# EAGLE schematic stages_v70 (EAGLE 5.09)

## Sheet 1 of 6
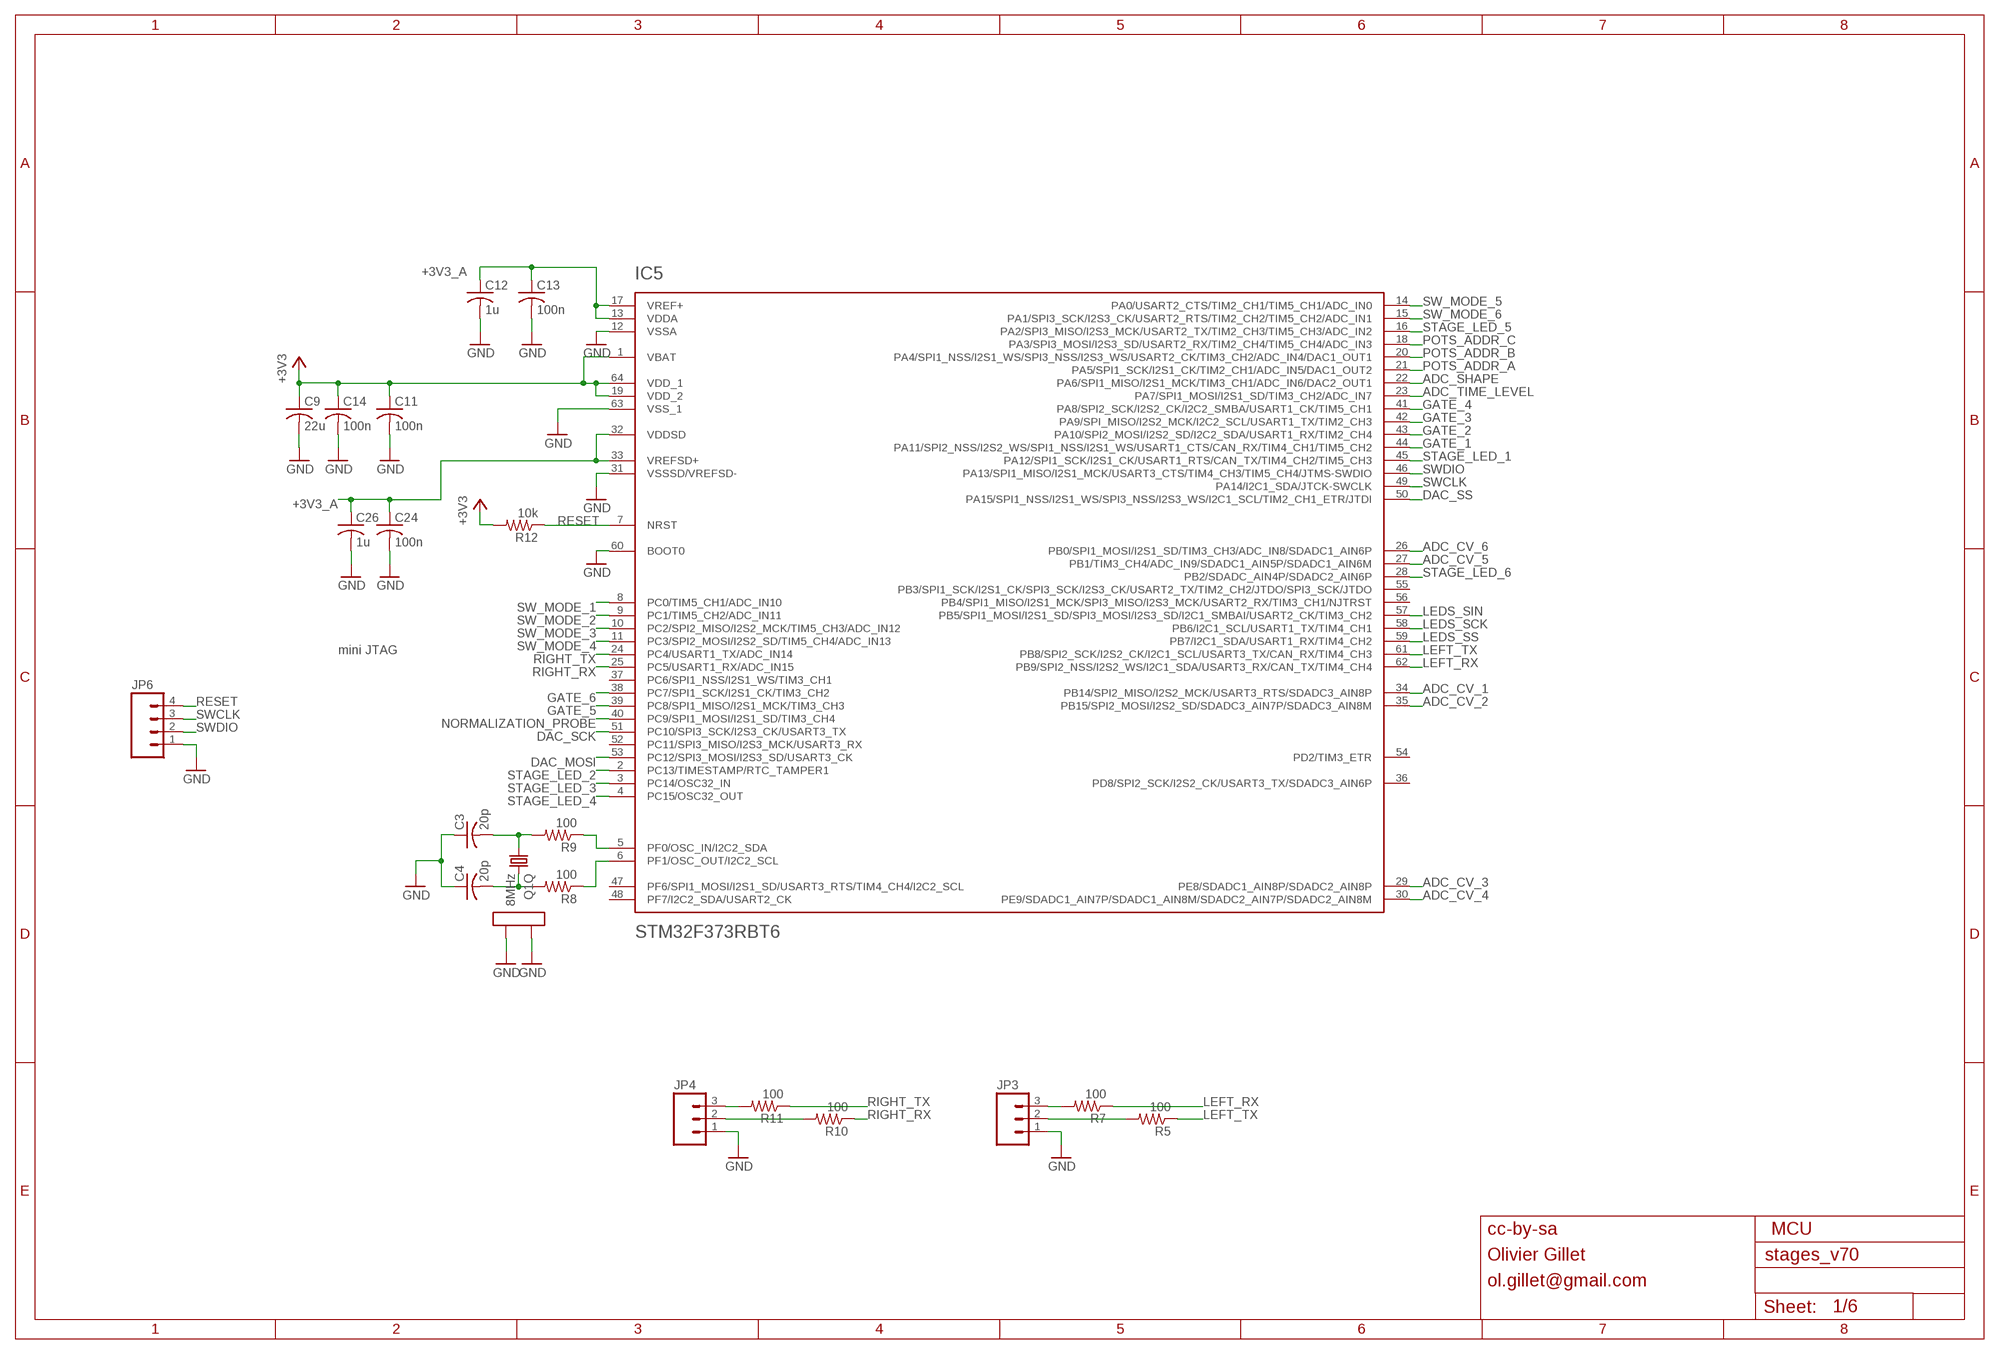
[diagram p0: schematic, sheet 1]

### Parts
C3  20p  C-USC0402  [C0402]
C4  20p  C-USC0402  [C0402]
C9  22u  C-USC1206  [C1206]
C11  100n  C-USC0402  [C0402]
C12  1u  C-USC0402  [C0402]
C13  100n  C-USC0402  [C0402]
C14  100n  C-USC0402  [C0402]
C24  100n  C-USC0402  [C0402]
C26  1u  C-USC0402  [C0402]
IC5  STM32F373RBT6  STM32F373R  [TQFP-10X10-64]
JP3  M03PTH  [1X03]
JP4  M03PTH  [1X03]
JP6  M04PTH  [1X04]
Q1  8MHz  CRYSTAL  [CTS406]
R5  100  R-US_R0402  [R0402]
R7  100  R-US_R0402  [R0402]
R8  100  R-US_R0402  [R0402]
R9  100  R-US_R0402  [R0402]
R10  100  R-US_R0402  [R0402]
R11  100  R-US_R0402  [R0402]
R12  10k  R-US_R0402  [R0402]

### Nets
+3V3: C9.1 C11.1 C14.1 IC5.1(VBAT) IC5.19(VDD_2) IC5.64(VDD_1) R12.2 ; also sheet 2,4,6
+3V3_A: C12.1 C13.1 C24.1 C26.1 IC5.13(VDDA) IC5.17(VREF+) IC5.32(VDDSD) IC5.33(VREFSD+) ; also sheet 2,3,5,6
ADC_CV_1: IC5.34(PB14/SPI2_MISO/I2S2_MCK/USART3_RTS/SDADC3_AIN8P) ; also sheet 3
ADC_CV_2: IC5.35(PB15/SPI2_MOSI/I2S2_SD/SDADC3_AIN7P/SDADC3_AIN8M) ; also sheet 3
ADC_CV_3: IC5.29(PE8/SDADC1_AIN8P/SDADC2_AIN8P) ; also sheet 3
ADC_CV_4: IC5.30(PE9/SDADC1_AIN7P/SDADC1_AIN8M/SDADC2_AIN7P/SDADC2_AIN8M) ; also sheet 3
ADC_CV_5: IC5.27(PB1/TIM3_CH4/ADC_IN9/SDADC1_AIN5P/SDADC1_AIN6M) ; also sheet 3
ADC_CV_6: IC5.26(PB0/SPI1_MOSI/I2S1_SD/TIM3_CH3/ADC_IN8/SDADC1_AIN6P) ; also sheet 3
ADC_SHAPE: IC5.22(PA6/SPI1_MISO/I2S1_MCK/TIM3_CH1/ADC_IN6/DAC2_OUT1) ; also sheet 2
ADC_TIME_LEVEL: IC5.23(PA7/SPI1_MOSI/I2S1_SD/TIM3_CH2/ADC_IN7) ; also sheet 2
DAC_MOSI: IC5.53(PC12/SPI3_MOSI/I2S3_SD/USART3_CK) ; also sheet 5
DAC_SCK: IC5.51(PC10/SPI3_SCK/I2S3_CK/USART3_TX) ; also sheet 5
DAC_SS: IC5.50(PA15/SPI1_NSS/I2S1_WS/SPI3_NSS/I2S3_WS/I2C1_SCL/TIM2_CH1_ETR/JTDI) ; also sheet 5
GATE_1: IC5.44(PA11/SPI2_NSS/I2S2_WS/SPI1_NSS/I2S1_WS/USART1_CTS/CAN_RX/TIM4_CH1/TIM5_CH2) ; also sheet 4
GATE_2: IC5.43(PA10/SPI2_MOSI/I2S2_SD/I2C2_SDA/USART1_RX/TIM2_CH4) ; also sheet 4
GATE_3: IC5.42(PA9/SPI_MISO/I2S2_MCK/I2C2_SCL/USART1_TX/TIM2_CH3) ; also sheet 4
GATE_4: IC5.41(PA8/SPI2_SCK/I2S2_CK/I2C2_SMBA/USART1_CK/TIM5_CH1) ; also sheet 4
GATE_5: IC5.39(PC8/SPI1_MISO/I2S1_MCK/TIM3_CH3) ; also sheet 4
GATE_6: IC5.38(PC7/SPI1_SCK/I2S1_CK/TIM3_CH2) ; also sheet 4
GND: C3.1 C4.1 C9.2 C11.2 C12.2 C13.2 C14.2 C24.2 C26.2 IC5.12(VSSA) IC5.31(VSSSD/VREFSD-) IC5.60(BOOT0) IC5.63(VSS_1) JP3.1 JP4.1 JP6.1 Q1.2(LID1) Q1.4(LID2) ; also sheet 2,3,4,5,6
LEDS_SCK: IC5.58(PB6/I2C1_SCL/USART1_TX/TIM4_CH1) ; also sheet 2
LEDS_SIN: IC5.57(PB5/SPI1_MOSI/I2S1_SD/SPI3_MOSI/I2S3_SD/I2C1_SMBAI/USART2_CK/TIM3_CH2) ; also sheet 2
LEDS_SS: IC5.59(PB7/I2C1_SDA/USART1_RX/TIM4_CH2) ; also sheet 2
LEFT_RX: IC5.62(PB9/SPI2_NSS/I2S2_WS/I2C1_SDA/USART3_RX/CAN_TX/TIM4_CH4) R7.1
LEFT_RX_R: JP3.3 R7.2
LEFT_TX: IC5.61(PB8/SPI2_SCK/I2S2_CK/I2C1_SCL/USART3_TX/CAN_RX/TIM4_CH3) R5.1
LEFT_TX_R: JP3.2 R5.2
N$7: C3.2 Q1.1 R9.2
N$8: C4.2 Q1.3 R8.2
N$15: IC5.5(PF0/OSC_IN/I2C2_SDA) R9.1
N$29: IC5.6(PF1/OSC_OUT/I2C2_SCL) R8.1
NORMALIZATION_PROBE: IC5.40(PC9/SPI1_MOSI/I2S1_SD/TIM3_CH4) ; also sheet 4
POTS_ADDR_A: IC5.21(PA5/SPI1_SCK/I2S1_CK/TIM2_CH1/ADC_IN5/DAC1_OUT2) ; also sheet 2
POTS_ADDR_B: IC5.20(PA4/SPI1_NSS/I2S1_WS/SPI3_NSS/I2S3_WS/USART2_CK/TIM3_CH2/ADC_IN4/DAC1_OUT1) ; also sheet 2
POTS_ADDR_C: IC5.18(PA3/SPI3_MOSI/I2S3_SD/USART2_RX/TIM2_CH4/TIM5_CH4/ADC_IN3) ; also sheet 2
RESET: IC5.7(NRST) JP6.4 R12.1
RIGHT_RX: IC5.25(PC5/USART1_RX/ADC_IN15) R10.1
RIGHT_RX_R: JP4.2 R10.2
RIGHT_TX: IC5.24(PC4/USART1_TX/ADC_IN14) R11.1
RIGHT_TX_R: JP4.3 R11.2
STAGE_LED_1: IC5.45(PA12/SPI1_SCK/I2S1_CK/USART1_RTS/CAN_TX/TIM4_CH2/TIM5_CH3) ; also sheet 2
STAGE_LED_2: IC5.2(PC13/TIMESTAMP/RTC_TAMPER1) ; also sheet 2
STAGE_LED_3: IC5.3(PC14/OSC32_IN) ; also sheet 2
STAGE_LED_4: IC5.4(PC15/OSC32_OUT) ; also sheet 2
STAGE_LED_5: IC5.16(PA2/SPI3_MISO/I2S3_MCK/USART2_TX/TIM2_CH3/TIM5_CH3/ADC_IN2) ; also sheet 2
STAGE_LED_6: IC5.28(PB2/SDADC_AIN4P/SDADC2_AIN6P) ; also sheet 2
SW_MODE_1: IC5.8(PC0/TIM5_CH1/ADC_IN10) ; also sheet 2
SW_MODE_2: IC5.9(PC1/TIM5_CH2/ADC_IN11) ; also sheet 2
SW_MODE_3: IC5.10(PC2/SPI2_MISO/I2S2_MCK/TIM5_CH3/ADC_IN12) ; also sheet 2
SW_MODE_4: IC5.11(PC3/SPI2_MOSI/I2S2_SD/TIM5_CH4/ADC_IN13) ; also sheet 2
SW_MODE_5: IC5.14(PA0/USART2_CTS/TIM2_CH1/TIM5_CH1/ADC_IN0) ; also sheet 2
SW_MODE_6: IC5.15(PA1/SPI3_SCK/I2S3_CK/USART2_RTS/TIM2_CH2/TIM5_CH2/ADC_IN1) ; also sheet 2
SWCLK: IC5.49(PA14/I2C1_SDA/JTCK-SWCLK) JP6.3
SWDIO: IC5.46(PA13/SPI1_MISO/I2S1_MCK/USART3_CTS/TIM4_CH3/TIM5_CH4/JTMS-SWDIO) JP6.2
Unconnected: IC5.36(PD8/SPI2_SCK/I2S2_CK/USART3_TX/SDADC3_AIN6P) IC5.37(PC6/SPI1_NSS/I2S1_WS/TIM3_CH1) IC5.47(PF6/SPI1_MOSI/I2S1_SD/USART3_RTS/TIM4_CH4/I2C2_SCL) IC5.48(PF7/I2C2_SDA/USART2_CK) IC5.52(PC11/SPI3_MISO/I2S3_MCK/USART3_RX) IC5.54(PD2/TIM3_ETR) IC5.55(PB3/SPI1_SCK/I2S1_CK/SPI3_SCK/I2S3_CK/USART2_TX/TIM2_CH2/JTDO/SPI3_SCK/JTDO) IC5.56(PB4/SPI1_MISO/I2S1_MCK/SPI3_MISO/I2S3_MCK/USART2_RX/TIM3_CH1/NJTRST)

### Notes on the sheet
- mini JTAG
- cc-by-sa | MCU
- Olivier Gillet
- ol.gillet@gmail.com

## Sheet 2 of 6
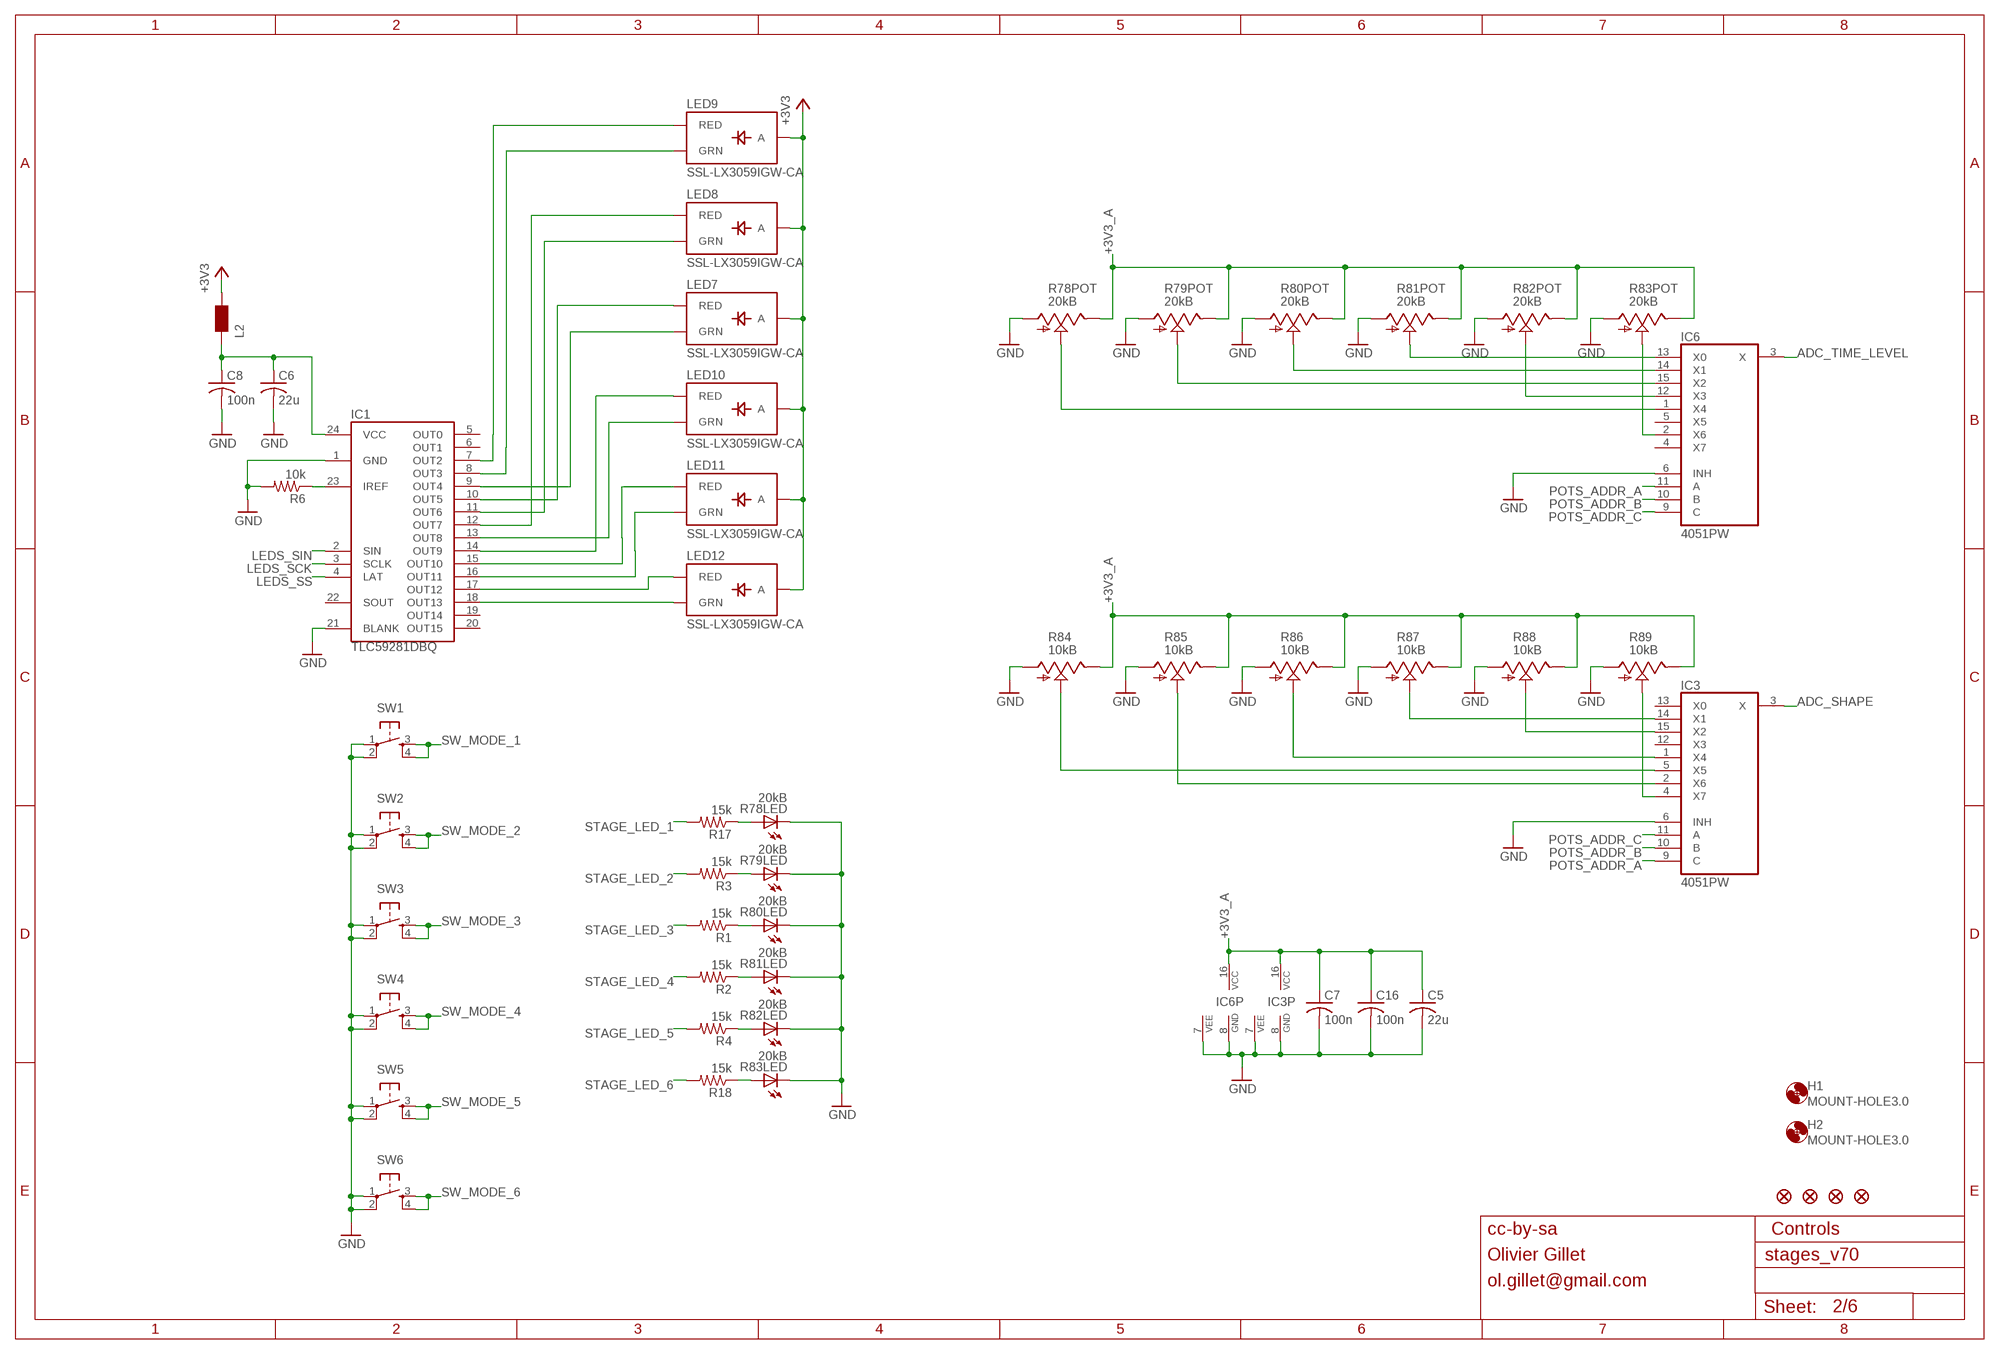
[diagram p1: schematic, sheet 2]

### Parts
C5  22u  C-USC1206  [C1206]
C6  22u  C-USC1206  [C1206]
C7  100n  C-USC0402  [C0402]
C8  100n  C-USC0402  [C0402]
C16  100n  C-USC0402  [C0402]
H1  MOUNT-HOLE3.0  [3,0]
H2  MOUNT-HOLE3.0  [3,0]
IC1  TLC59281DBQ  [TSSOP24_0635]
IC3  4051PW  [TSSOP16_065]
IC6  4051PW  [TSSOP16_065]
JP1  FIDUCIAL1X2  [FIDUCIAL-1X2]
JP2  FIDUCIAL1X2  [FIDUCIAL-1X2]
JP7  FIDUCIAL1X2  [FIDUCIAL-1X2]
JP8  FIDUCIAL1X2  [FIDUCIAL-1X2]
L2  WE-CBF_0603  [0603]
LED7  SSL-LX3059IGW-CA  LED-BICOLOR-THROUGHHOLE-CA  [LED-BICOLOR-THROUGHHOLE-LUMEX]
LED8  SSL-LX3059IGW-CA  LED-BICOLOR-THROUGHHOLE-CA  [LED-BICOLOR-THROUGHHOLE-LUMEX]
LED9  SSL-LX3059IGW-CA  LED-BICOLOR-THROUGHHOLE-CA  [LED-BICOLOR-THROUGHHOLE-LUMEX]
LED10  SSL-LX3059IGW-CA  LED-BICOLOR-THROUGHHOLE-CA  [LED-BICOLOR-THROUGHHOLE-LUMEX]
LED11  SSL-LX3059IGW-CA  LED-BICOLOR-THROUGHHOLE-CA  [LED-BICOLOR-THROUGHHOLE-LUMEX]
LED12  SSL-LX3059IGW-CA  LED-BICOLOR-THROUGHHOLE-CA  [LED-BICOLOR-THROUGHHOLE-LUMEX]
R1  15k  R-US_R0402  [R0402]
R2  15k  R-US_R0402  [R0402]
R3  15k  R-US_R0402  [R0402]
R4  15k  R-US_R0402  [R0402]
R6  10k  R-US_R0402  [R0402]
R17  15k  R-US_R0402  [R0402]
R18  15k  R-US_R0402  [R0402]
R78  20kB  BOURNS_SLIDER  [BOURNS_SLIDER]
R79  20kB  BOURNS_SLIDER  [BOURNS_SLIDER]
R80  20kB  BOURNS_SLIDER  [BOURNS_SLIDER]
R81  20kB  BOURNS_SLIDER  [BOURNS_SLIDER]
R82  20kB  BOURNS_SLIDER  [BOURNS_SLIDER]
R83  20kB  BOURNS_SLIDER  [BOURNS_SLIDER]
R84  10kB  POT_USVERTICAL_NARROW  [ALPS_POT_NARROW]
R85  10kB  POT_USVERTICAL_NARROW  [ALPS_POT_NARROW]
R86  10kB  POT_USVERTICAL_NARROW  [ALPS_POT_NARROW]
R87  10kB  POT_USVERTICAL_NARROW  [ALPS_POT_NARROW]
R88  10kB  POT_USVERTICAL_NARROW  [ALPS_POT_NARROW]
R89  10kB  POT_USVERTICAL_NARROW  [ALPS_POT_NARROW]
SW1  TAC_SWITCHPTH  [TACTILE-PTH]
SW2  TAC_SWITCHPTH  [TACTILE-PTH]
SW3  TAC_SWITCHPTH  [TACTILE-PTH]
SW4  TAC_SWITCHPTH  [TACTILE-PTH]
SW5  TAC_SWITCHPTH  [TACTILE-PTH]
SW6  TAC_SWITCHPTH  [TACTILE-PTH]

### Nets
+3V3: L2.2 LED7.A LED8.A LED9.A LED10.A LED11.A LED12.A ; also sheet 1,4,6
+3V3_A: C5.1 C7.1 C16.1 IC3.16(VCC) IC6.16(VCC) R78.3(POT:E) R79.3(POT:E) R80.3(POT:E) R81.3(POT:E) R82.3(POT:E) R83.3(POT:E) R84.P$1(E) R85.P$1(E) R86.P$1(E) R87.P$1(E) R88.P$1(E) R89.P$1(E) ; also sheet 1,3,5,6
ADC_SHAPE: IC3.3(X) ; also sheet 1
ADC_TIME_LEVEL: IC6.3(X) ; also sheet 1
GND: C5.2 C6.2 C7.2 C8.2 C16.2 IC1.1(GND) IC1.21(BLANK) IC3.6(INH) IC3.7(VEE) IC3.8(GND) IC6.6(INH) IC6.7(VEE) IC6.8(GND) R6.2 R78.1(POT:A) R78.E(LED:C) R79.1(POT:A) R79.E(LED:C) R80.1(POT:A) R80.E(LED:C) R81.1(POT:A) R81.E(LED:C) R82.1(POT:A) R82.E(LED:C) R83.1(POT:A) R83.E(LED:C) R84.P$3(A) R85.P$3(A) R86.P$3(A) R87.P$3(A) R88.P$3(A) R89.P$3(A) SW1.1 SW1.2 SW2.1 SW2.2 SW3.1 SW3.2 SW4.1 SW4.2 SW5.1 SW5.2 SW6.1 SW6.2 ; also sheet 1,3,4,5,6
LEDS_SCK: IC1.3(SCLK) ; also sheet 1
LEDS_SIN: IC1.2(SIN) ; also sheet 1
LEDS_SS: IC1.4(LAT) ; also sheet 1
N$2: IC1.10(OUT5) LED7.RED_C(RED)
N$3: IC1.18(OUT13) LED12.GREEN_C(GRN)
N$4: IC1.12(OUT7) LED8.RED_C(RED)
N$6: IC1.7(OUT2) LED9.RED_C(RED)
N$9: IC1.8(OUT3) LED9.GREEN_C(GRN)
N$10: IC1.13(OUT8) LED10.GREEN_C(GRN)
N$12: IC1.15(OUT10) LED11.RED_C(RED)
N$13: R17.1 R78.B(LED:A)
N$14: IC1.16(OUT11) LED11.GREEN_C(GRN)
N$16: IC1.17(OUT12) LED12.RED_C(RED)
N$22: IC1.11(OUT6) LED8.GREEN_C(GRN)
N$31: C6.1 C8.1 IC1.24(VCC) L2.1
N$43: IC1.14(OUT9) LED10.RED_C(RED)
N$48: IC6.1(X4) R78.2(POT:S)
N$49: R18.1 R83.B(LED:A)
N$51: IC6.2(X6) R83.2(POT:S)
N$53: IC6.12(X3) R82.2(POT:S)
N$54: IC6.13(X0) R81.2(POT:S)
N$55: IC6.14(X1) R80.2(POT:S)
N$56: IC6.15(X2) R79.2(POT:S)
N$58: IC3.2(X6) R85.P$2(S)
N$59: IC3.4(X7) R89.P$2(S)
N$60: IC3.1(X4) R86.P$2(S)
N$61: IC3.14(X1) R87.P$2(S)
N$62: IC3.15(X2) R88.P$2(S)
N$63: IC3.5(X5) R84.P$2(S)
N$64: R4.1 R82.B(LED:A)
N$68: IC1.23(IREF) R6.1
N$100: R2.1 R81.B(LED:A)
N$101: IC1.9(OUT4) LED7.GREEN_C(GRN)
N$102: R1.1 R80.B(LED:A)
N$103: R3.1 R79.B(LED:A)
POTS_ADDR_A: IC3.9(C) IC6.11(A) ; also sheet 1
POTS_ADDR_B: IC3.10(B) IC6.10(B) ; also sheet 1
POTS_ADDR_C: IC3.11(A) IC6.9(C) ; also sheet 1
STAGE_LED_1: R17.2 ; also sheet 1
STAGE_LED_2: R3.2 ; also sheet 1
STAGE_LED_3: R1.2 ; also sheet 1
STAGE_LED_4: R2.2 ; also sheet 1
STAGE_LED_5: R4.2 ; also sheet 1
STAGE_LED_6: R18.2 ; also sheet 1
SW_MODE_1: SW1.3 SW1.4 ; also sheet 1
SW_MODE_2: SW2.3 SW2.4 ; also sheet 1
SW_MODE_3: SW3.3 SW3.4 ; also sheet 1
SW_MODE_4: SW4.3 SW4.4 ; also sheet 1
SW_MODE_5: SW5.3 SW5.4 ; also sheet 1
SW_MODE_6: SW6.3 SW6.4 ; also sheet 1
Unconnected: IC1.5(OUT0) IC1.6(OUT1) IC1.19(OUT14) IC1.20(OUT15) IC1.22(SOUT) IC3.12(X3) IC3.13(X0) IC6.4(X7) IC6.5(X5)

### Notes on the sheet
- cc-by-sa | Controls
- Olivier Gillet
- ol.gillet@gmail.com

## Sheet 3 of 6
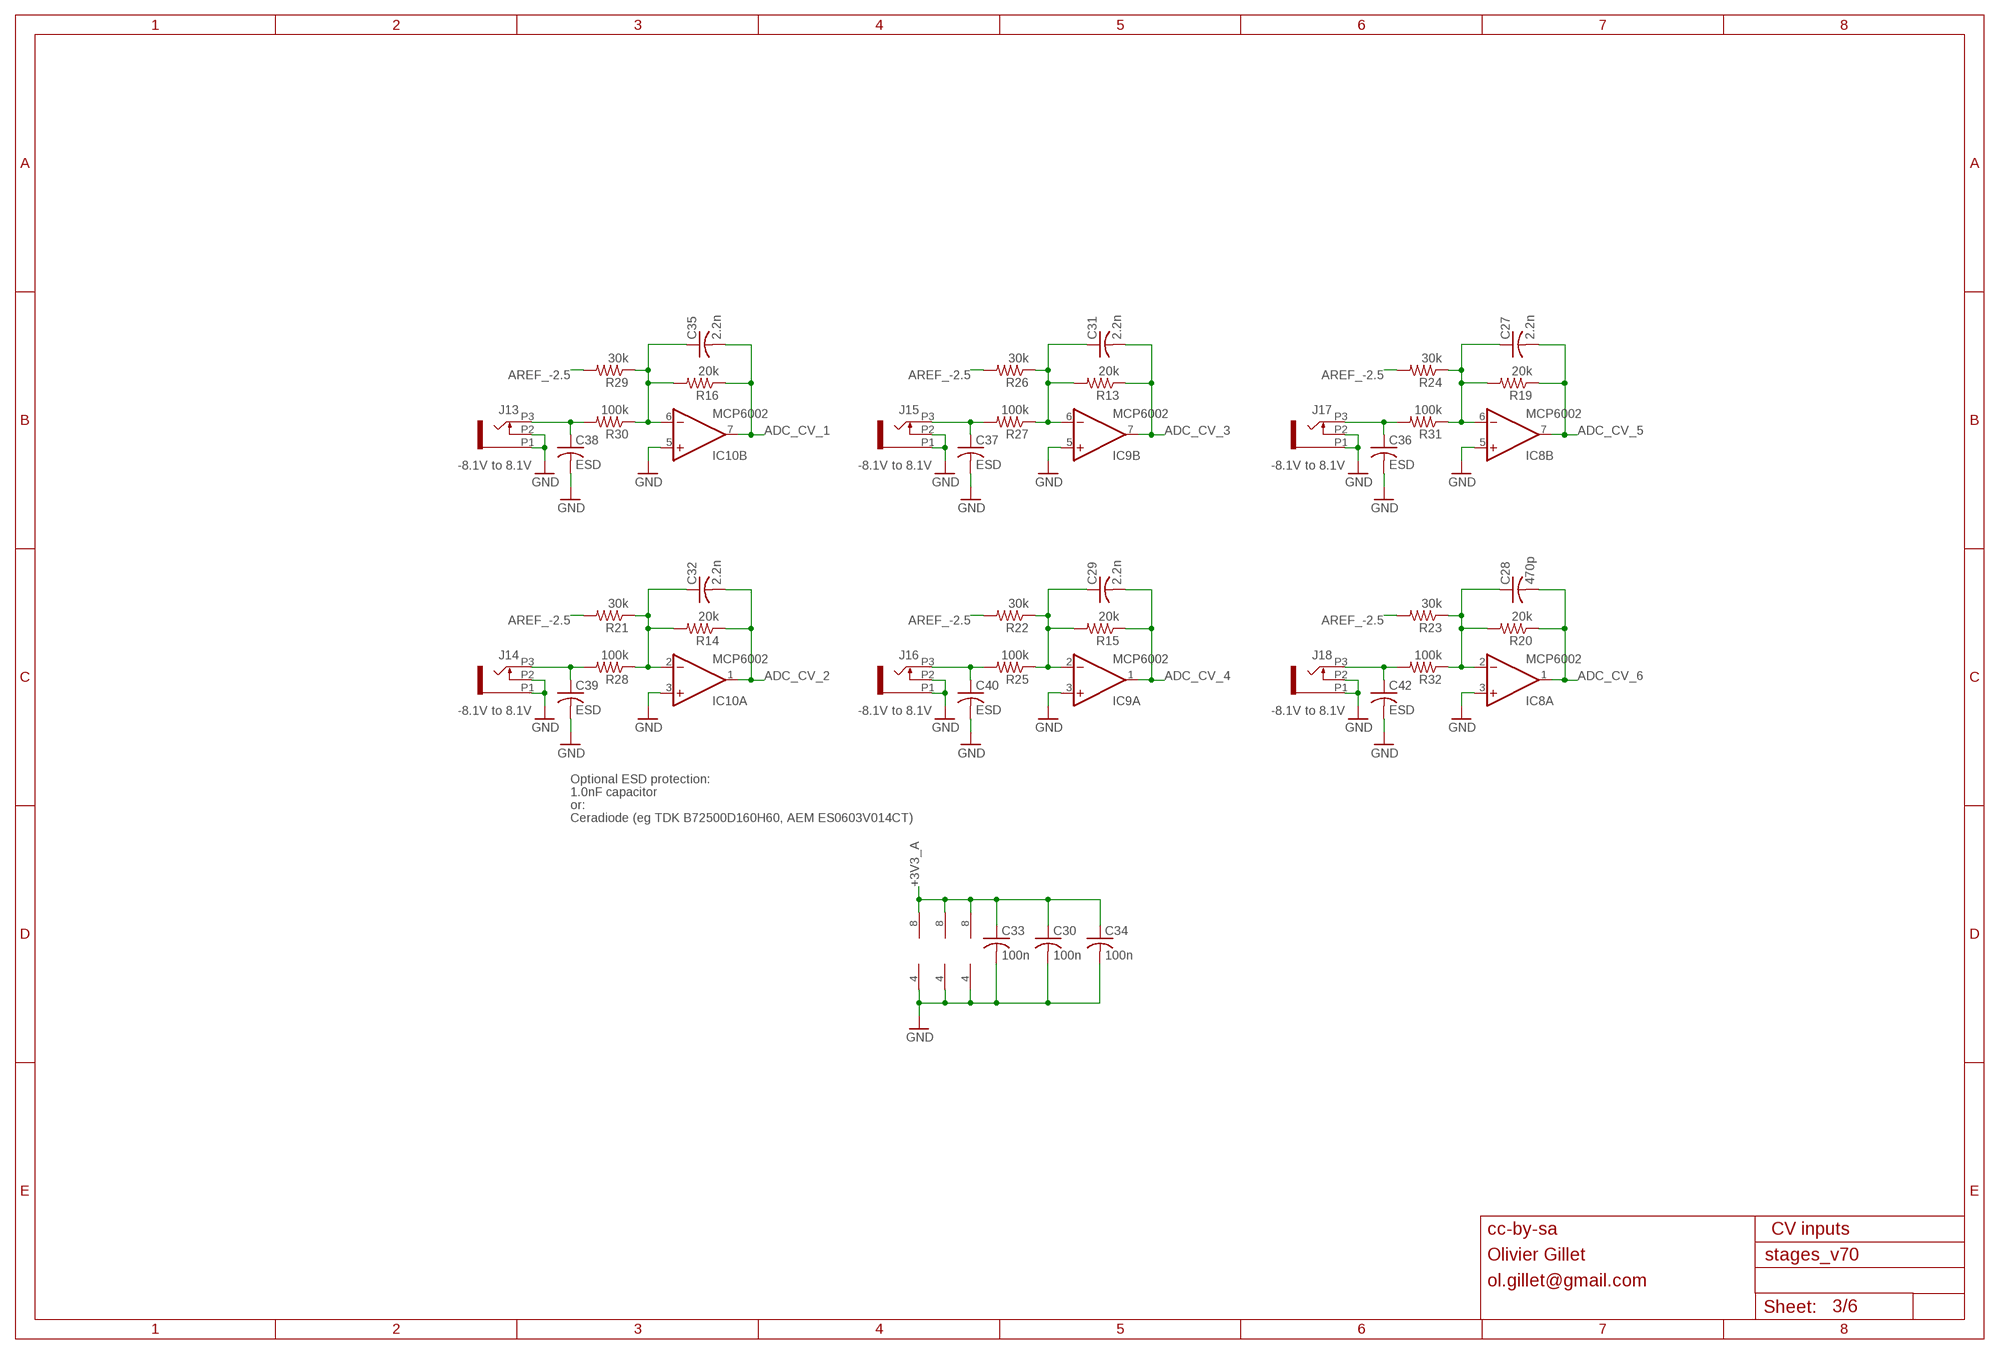
[diagram p2: schematic, sheet 3]

### Parts
C27  2.2n  C-USC0402  [C0402]
C28  470p  C-USC0402  [C0402]
C29  2.2n  C-USC0402  [C0402]
C30  100n  C-USC0402  [C0402]
C31  2.2n  C-USC0402  [C0402]
C32  2.2n  C-USC0402  [C0402]
C33  100n  C-USC0402  [C0402]
C34  100n  C-USC0402  [C0402]
C35  2.2n  C-USC0402  [C0402]
C36  ESD  C-USC0603  [C0603]
C37  ESD  C-USC0603  [C0603]
C38  ESD  C-USC0603  [C0603]
C39  ESD  C-USC0603  [C0603]
C40  ESD  C-USC0603  [C0603]
C42  ESD  C-USC0603  [C0603]
IC8  MCP6002  OPA1652DGK  [MSOP-8]
IC9  MCP6002  OPA1652DGK  [MSOP-8]
IC10  MCP6002  OPA1652DGK  [MSOP-8]
J13  PJ301_THONKICONN6  [WQP_PJ_301M6]
J14  PJ301_THONKICONN6  [WQP_PJ_301M6]
J15  PJ301_THONKICONN6  [WQP_PJ_301M6]
J16  PJ301_THONKICONN6  [WQP_PJ_301M6]
J17  PJ301_THONKICONN6  [WQP_PJ_301M6]
J18  PJ301_THONKICONN6  [WQP_PJ_301M6]
R13  20k  R-US_R0402  [R0402]
R14  20k  R-US_R0402  [R0402]
R15  20k  R-US_R0402  [R0402]
R16  20k  R-US_R0402  [R0402]
R19  20k  R-US_R0402  [R0402]
R20  20k  R-US_R0402  [R0402]
R21  30k  R-US_R0402  [R0402]
R22  30k  R-US_R0402  [R0402]
R23  30k  R-US_R0402  [R0402]
R24  30k  R-US_R0402  [R0402]
R25  100k  R-US_R0402  [R0402]
R26  30k  R-US_R0402  [R0402]
R27  100k  R-US_R0402  [R0402]
R28  100k  R-US_R0402  [R0402]
R29  30k  R-US_R0402  [R0402]
R30  100k  R-US_R0402  [R0402]
R31  100k  R-US_R0402  [R0402]
R32  100k  R-US_R0402  [R0402]

### Nets
+3V3_A: C30.1 C33.1 C34.1 IC8.8(P:V+) IC9.8(P:V+) IC10.8(P:V+) ; also sheet 1,2,5,6
ADC_CV_1: C35.2 IC10.7(B:OUT) R16.1 ; also sheet 1
ADC_CV_2: C32.2 IC10.1(A:OUT) R14.1 ; also sheet 1
ADC_CV_3: C31.2 IC9.7(B:OUT) R13.1 ; also sheet 1
ADC_CV_4: C29.2 IC9.1(A:OUT) R15.1 ; also sheet 1
ADC_CV_5: C27.2 IC8.7(B:OUT) R19.1 ; also sheet 1
ADC_CV_6: C28.2 IC8.1(A:OUT) R20.1 ; also sheet 1
AREF_-2.5: R21.2 R22.2 R23.2 R24.2 R26.2 R29.2 ; also sheet 6
GND: C30.2 C33.2 C34.2 C36.2 C37.2 C38.2 C39.2 C40.2 C42.2 IC8.3(A:+IN) IC8.4(P:V-) IC8.5(B:+IN) IC9.3(A:+IN) IC9.4(P:V-) IC9.5(B:+IN) IC10.3(A:+IN) IC10.4(P:V-) IC10.5(B:+IN) J13.P1 J13.P2 J14.P1 J14.P2 J15.P1 J15.P2 J16.P1 J16.P2 J17.P1 J17.P2 J18.P1 J18.P2 ; also sheet 1,2,4,5,6
MORPH_IN: C38.1 J13.P3 R30.2
MORPH_IN1: C39.1 J14.P3 R28.2
MORPH_IN2: C37.1 J15.P3 R27.2
MORPH_IN3: C40.1 J16.P3 R25.2
MORPH_IN4: C36.1 J17.P3 R31.2
MORPH_IN5: C42.1 J18.P3 R32.2
N$30: C35.1 IC10.6(B:-IN) R16.2 R29.1 R30.1
N$32: C32.1 IC10.2(A:-IN) R14.2 R21.1 R28.1
N$34: C31.1 IC9.6(B:-IN) R13.2 R26.1 R27.1
N$37: C29.1 IC9.2(A:-IN) R15.2 R22.1 R25.1
N$39: C27.1 IC8.6(B:-IN) R19.2 R24.1 R31.1
N$41: C28.1 IC8.2(A:-IN) R20.2 R23.1 R32.1

### Notes on the sheet
- -8.1V to 8.1V | -8.1V to 8.1V | -8.1V to 8.1V
- -8.1V to 8.1V | -8.1V to 8.1V | -8.1V to 8.1V
- Optional ESD protection:
- 1.0nF capacitor
- or:
- Ceradiode (eg TDK B72500D160H60, AEM ES0603V014CT)
- cc-by-sa | CV inputs
- Olivier Gillet
- ol.gillet@gmail.com

## Sheet 4 of 6
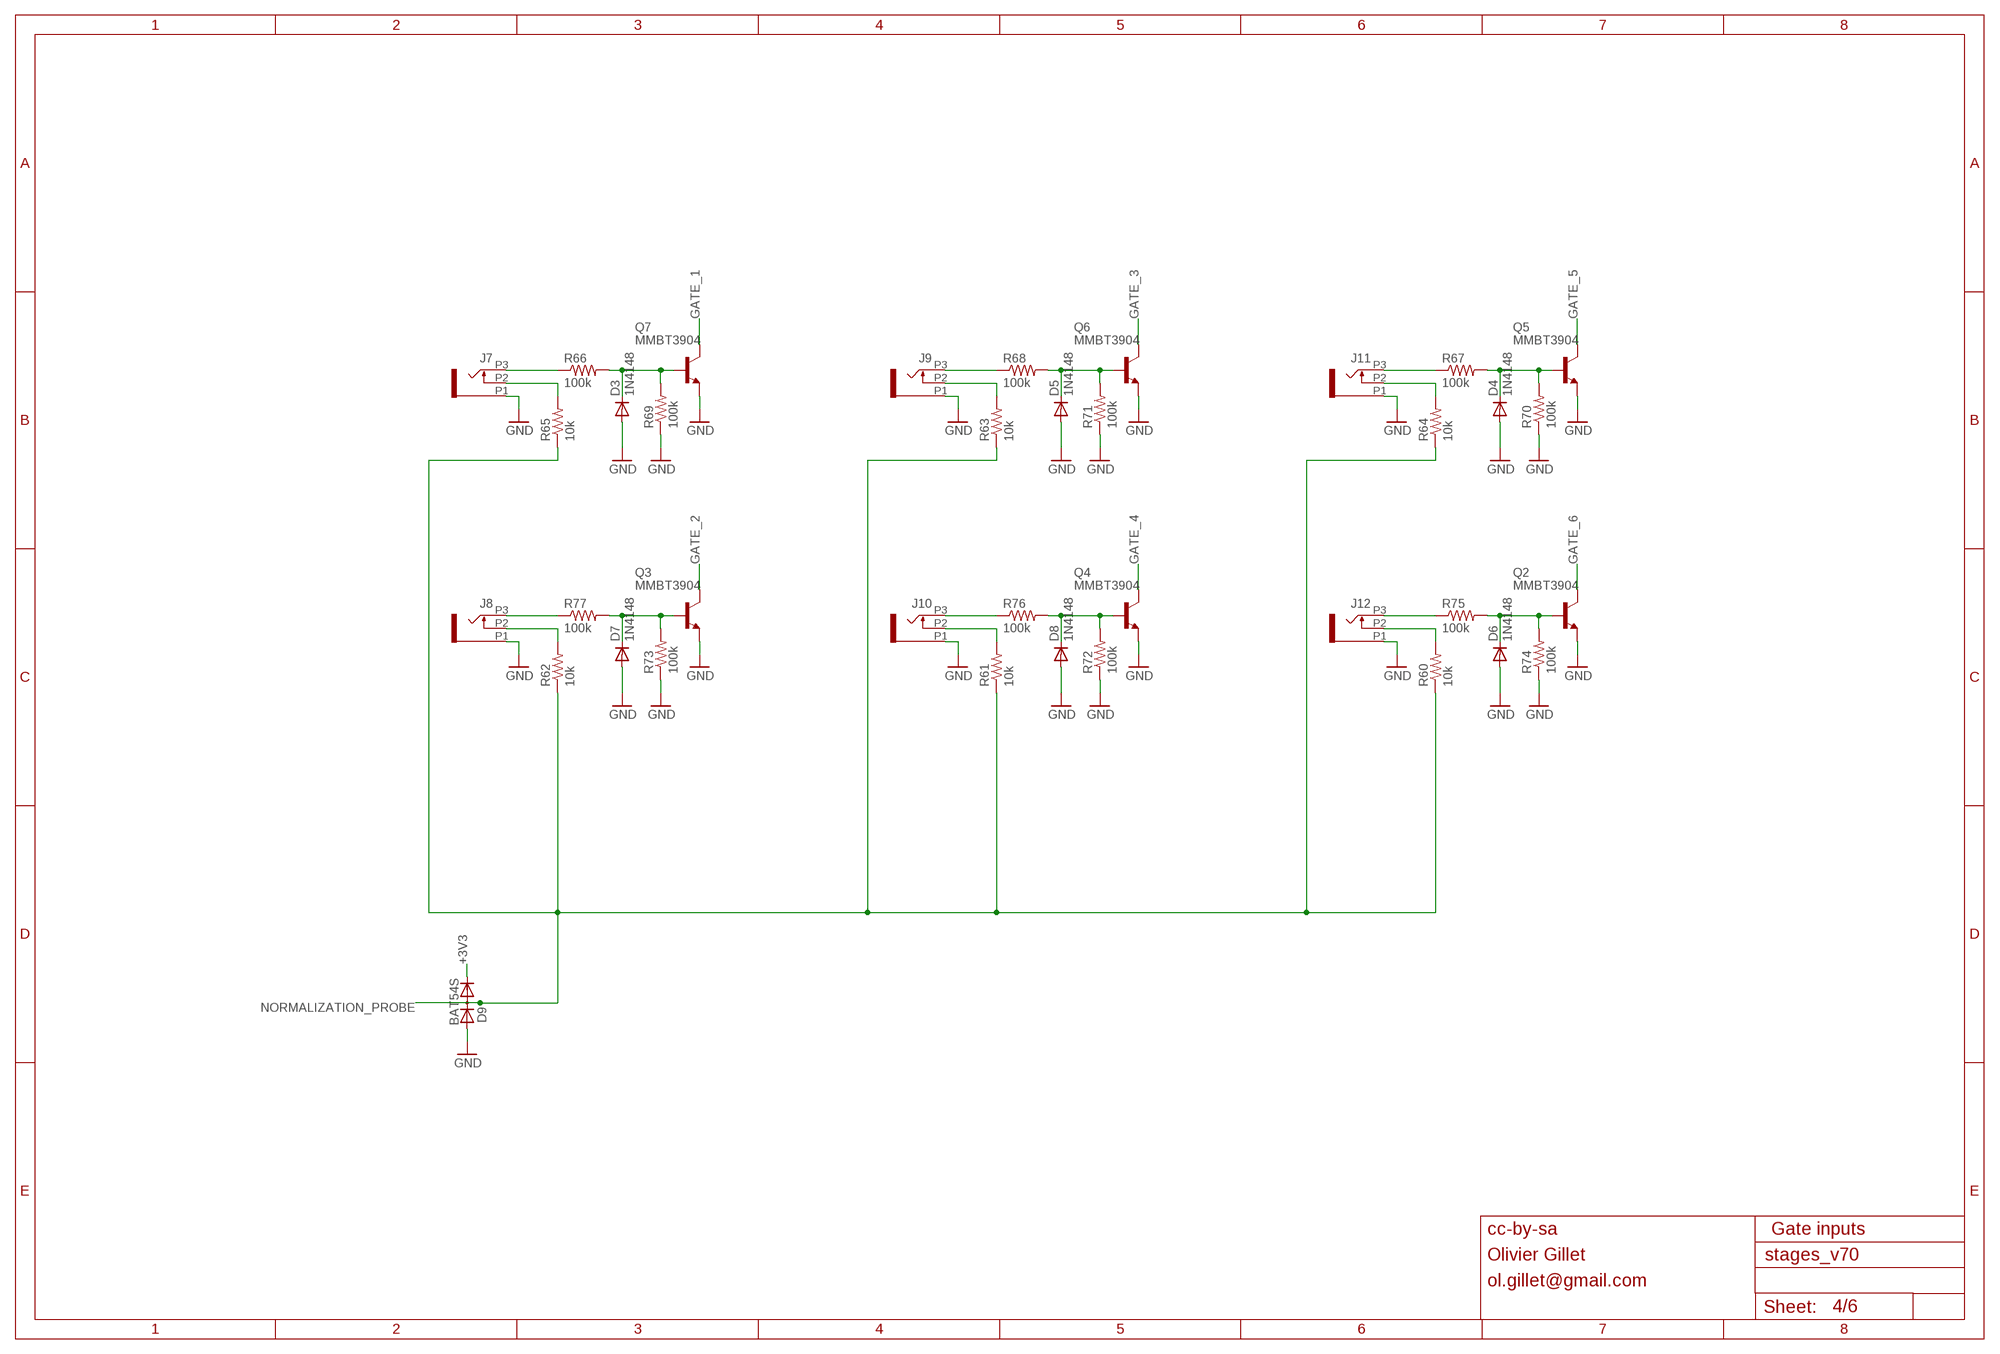
[diagram p3: schematic, sheet 4]

### Parts
D3  1N4148  DIODE-SOD523  [SOD523]
D4  1N4148  DIODE-SOD523  [SOD523]
D5  1N4148  DIODE-SOD523  [SOD523]
D6  1N4148  DIODE-SOD523  [SOD523]
D7  1N4148  DIODE-SOD523  [SOD523]
D8  1N4148  DIODE-SOD523  [SOD523]
D9  BAT54S  DIODE_2CACA-SOT23  [SOT23]
J7  PJ301_THONKICONN6  [WQP_PJ_301M6]
J8  PJ301_THONKICONN6  [WQP_PJ_301M6]
J9  PJ301_THONKICONN6  [WQP_PJ_301M6]
J10  PJ301_THONKICONN6  [WQP_PJ_301M6]
J11  PJ301_THONKICONN6  [WQP_PJ_301M6]
J12  PJ301_THONKICONN6  [WQP_PJ_301M6]
Q2  MMBT3904  MMBT3904LT1-NPN-SOT23-BEC  [SOT23-BEC]
Q3  MMBT3904  MMBT3904LT1-NPN-SOT23-BEC  [SOT23-BEC]
Q4  MMBT3904  MMBT3904LT1-NPN-SOT23-BEC  [SOT23-BEC]
Q5  MMBT3904  MMBT3904LT1-NPN-SOT23-BEC  [SOT23-BEC]
Q6  MMBT3904  MMBT3904LT1-NPN-SOT23-BEC  [SOT23-BEC]
Q7  MMBT3904  MMBT3904LT1-NPN-SOT23-BEC  [SOT23-BEC]
R60  10k  R-US_R0402  [R0402]
R61  10k  R-US_R0402  [R0402]
R62  10k  R-US_R0402  [R0402]
R63  10k  R-US_R0402  [R0402]
R64  10k  R-US_R0402  [R0402]
R65  10k  R-US_R0402  [R0402]
R66  100k  R-US_R0402  [R0402]
R67  100k  R-US_R0402  [R0402]
R68  100k  R-US_R0402  [R0402]
R69  100k  R-US_R0402  [R0402]
R70  100k  R-US_R0402  [R0402]
R71  100k  R-US_R0402  [R0402]
R72  100k  R-US_R0402  [R0402]
R73  100k  R-US_R0402  [R0402]
R74  100k  R-US_R0402  [R0402]
R75  100k  R-US_R0402  [R0402]
R76  100k  R-US_R0402  [R0402]
R77  100k  R-US_R0402  [R0402]

### Nets
+3V3: D9.2(C) ; also sheet 1,2,6
GATE_1: Q7.C ; also sheet 1
GATE_2: Q3.C ; also sheet 1
GATE_3: Q6.C ; also sheet 1
GATE_4: Q4.C ; also sheet 1
GATE_5: Q5.C ; also sheet 1
GATE_6: Q2.C ; also sheet 1
GND: D3.A D4.A D5.A D6.A D7.A D8.A D9.1(A) J7.P1 J8.P1 J9.P1 J10.P1 J11.P1 J12.P1 Q2.E Q3.E Q4.E Q5.E Q6.E Q7.E R69.1 R70.1 R71.1 R72.1 R73.1 R74.1 ; also sheet 1,2,3,5,6
N$1: J9.P3 R68.1
N$5: J10.P3 R76.1
N$17: J10.P2 R61.2
N$19: J9.P2 R63.2
N$20: D5.C Q6.B R68.2 R71.2
N$21: D8.C Q4.B R72.2 R76.2
N$23: J11.P3 R67.1
N$24: J12.P3 R75.1
N$25: J12.P2 R60.2
N$26: J11.P2 R64.2
N$27: D4.C Q5.B R67.2 R70.2
N$28: D6.C Q2.B R74.2 R75.2
N$36: J8.P3 R77.1
N$46: J8.P2 R62.2
N$47: J7.P2 R65.2
N$50: D3.C Q7.B R66.2 R69.2
N$52: D7.C Q3.B R73.2 R77.2
N$57: J7.P3 R66.1
NORMALIZATION_PROBE: D9.3(AC) R60.1 R61.1 R62.1 R63.1 R64.1 R65.1 ; also sheet 1

### Notes on the sheet
- cc-by-sa | Gate inputs
- Olivier Gillet
- ol.gillet@gmail.com

## Sheet 5 of 6
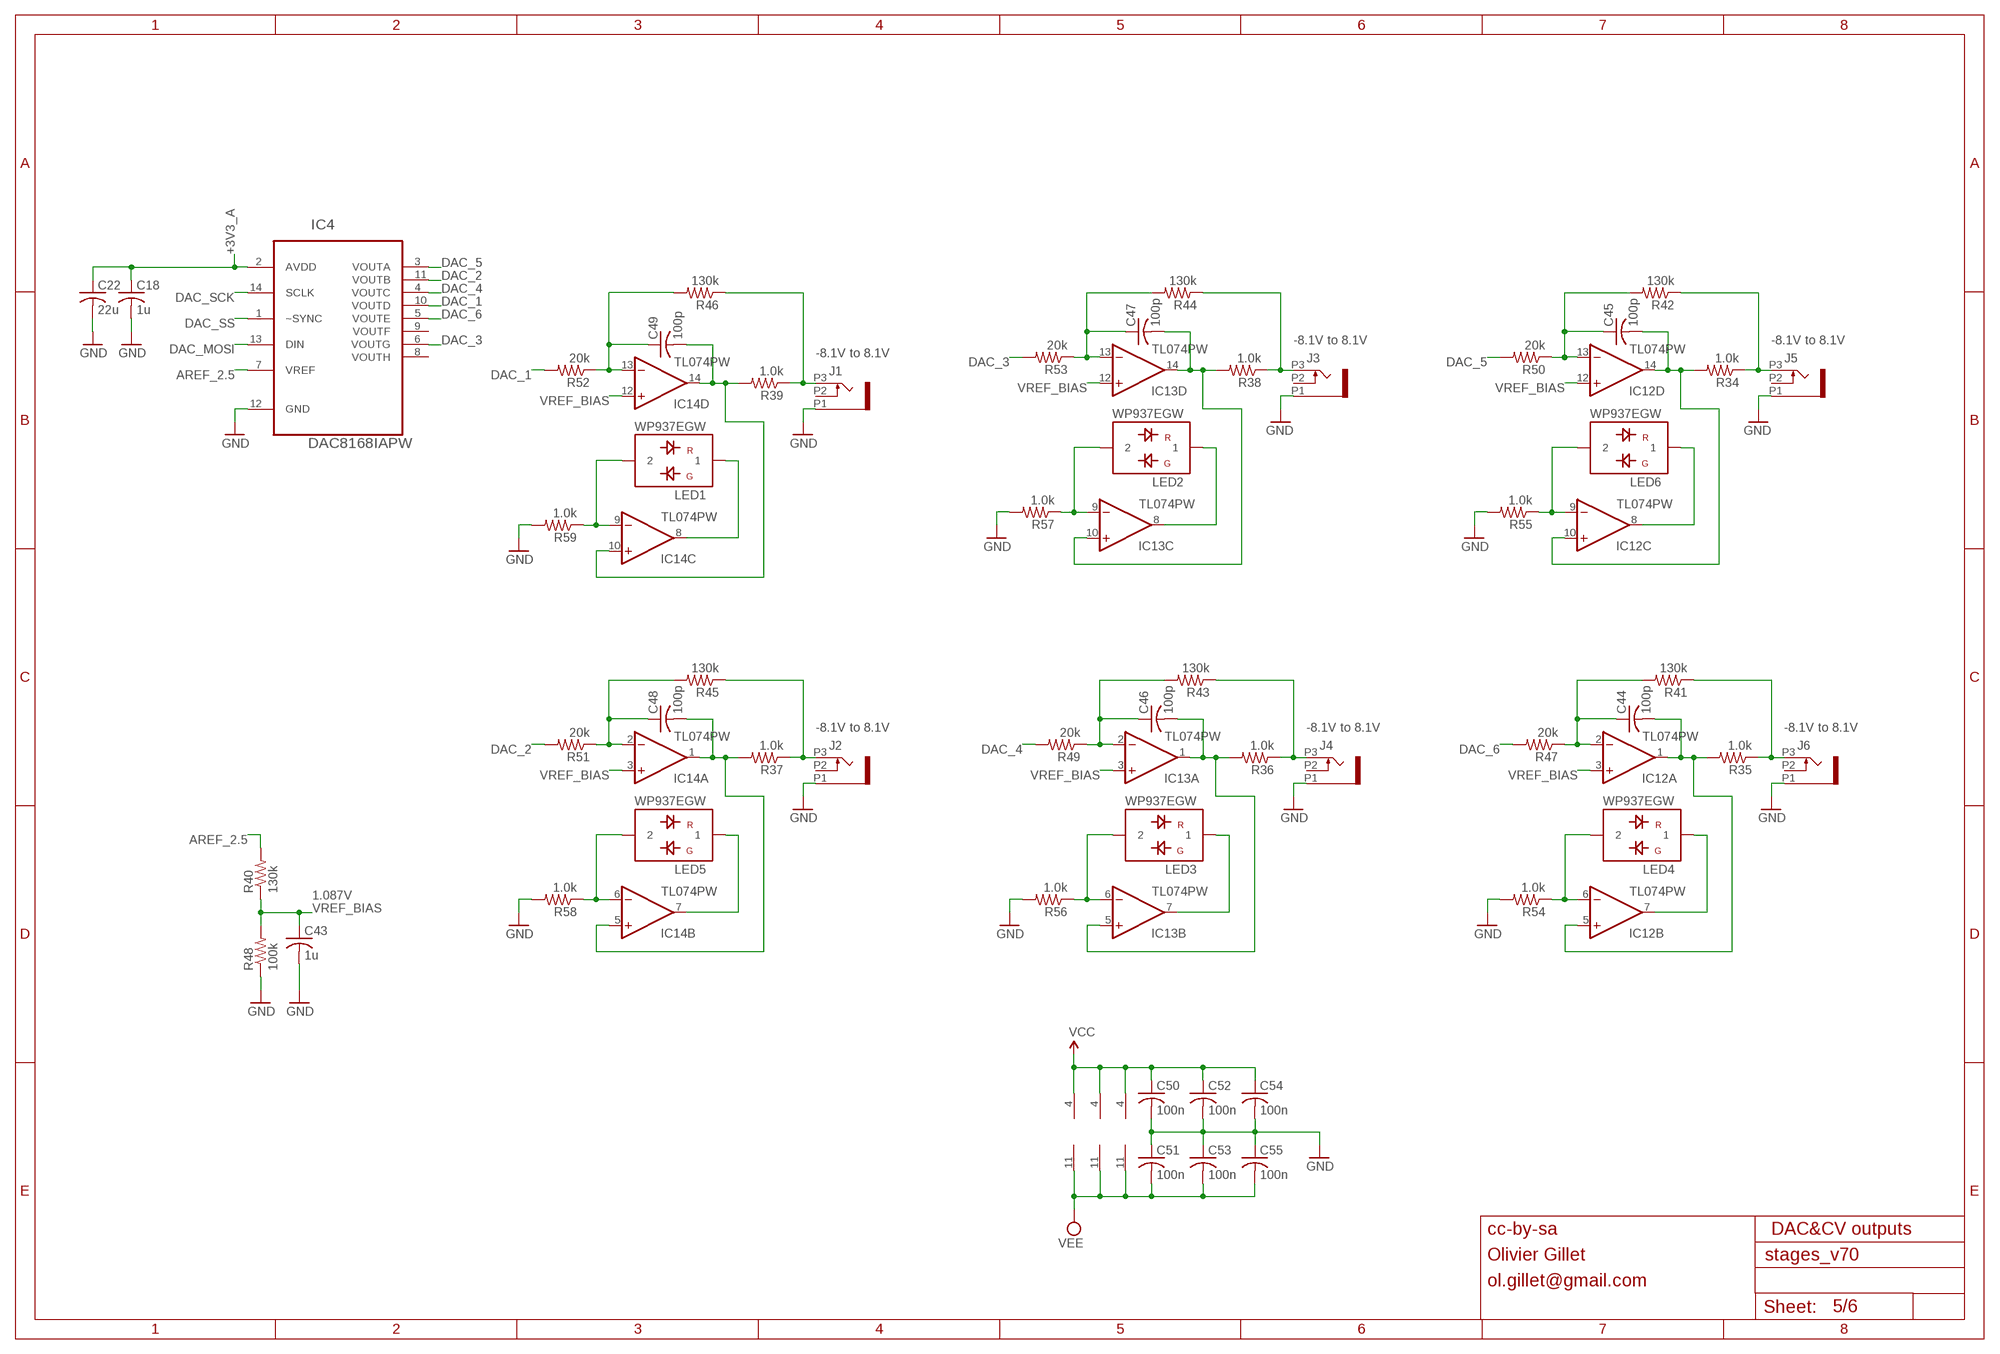
[diagram p4: schematic, sheet 5]

### Parts
C18  1u  C-USC0402  [C0402]
C22  22u  C-USC1206  [C1206]
C43  1u  C-USC0402  [C0402]
C44  100p  C-USC0402  [C0402]
C45  100p  C-USC0402  [C0402]
C46  100p  C-USC0402  [C0402]
C47  100p  C-USC0402  [C0402]
C48  100p  C-USC0402  [C0402]
C49  100p  C-USC0402  [C0402]
C50  100n  C-USC0402  [C0402]
C51  100n  C-USC0402  [C0402]
C52  100n  C-USC0402  [C0402]
C53  100n  C-USC0402  [C0402]
C54  100n  C-USC0402  [C0402]
C55  100n  C-USC0402  [C0402]
IC4  DAC8168IAPW  DAC8168PW  [RPDSOG14]
IC12  TL074PW  [TSSOP14_065]
IC13  TL074PW  [TSSOP14_065]
IC14  TL074PW  [TSSOP14_065]
J1  PJ301_THONKICONN6  [WQP_PJ_301M6]
J2  PJ301_THONKICONN6  [WQP_PJ_301M6]
J3  PJ301_THONKICONN6  [WQP_PJ_301M6]
J4  PJ301_THONKICONN6  [WQP_PJ_301M6]
J5  PJ301_THONKICONN6  [WQP_PJ_301M6]
J6  PJ301_THONKICONN6  [WQP_PJ_301M6]
LED1  WP937EGW  LED-BICOLOR-SHARED-THROUGHHOLE  [LED3MM]
LED2  WP937EGW  LED-BICOLOR-SHARED-THROUGHHOLE  [LED3MM]
LED3  WP937EGW  LED-BICOLOR-SHARED-THROUGHHOLE  [LED3MM]
LED4  WP937EGW  LED-BICOLOR-SHARED-THROUGHHOLE  [LED3MM]
LED5  WP937EGW  LED-BICOLOR-SHARED-THROUGHHOLE  [LED3MM]
LED6  WP937EGW  LED-BICOLOR-SHARED-THROUGHHOLE  [LED3MM]
R34  1.0k  R-US_R0603  [R0603]
R35  1.0k  R-US_R0603  [R0603]
R36  1.0k  R-US_R0603  [R0603]
R37  1.0k  R-US_R0603  [R0603]
R38  1.0k  R-US_R0603  [R0603]
R39  1.0k  R-US_R0603  [R0603]
R40  130k  R-US_R0402  [R0402]
R41  130k  R-US_R0402  [R0402]
R42  130k  R-US_R0402  [R0402]
R43  130k  R-US_R0402  [R0402]
R44  130k  R-US_R0402  [R0402]
R45  130k  R-US_R0402  [R0402]
R46  130k  R-US_R0402  [R0402]
R47  20k  R-US_R0402  [R0402]
R48  100k  R-US_R0402  [R0402]
R49  20k  R-US_R0402  [R0402]
R50  20k  R-US_R0402  [R0402]
R51  20k  R-US_R0402  [R0402]
R52  20k  R-US_R0402  [R0402]
R53  20k  R-US_R0402  [R0402]
R54  1.0k  R-US_R0402  [R0402]
R55  1.0k  R-US_R0402  [R0402]
R56  1.0k  R-US_R0402  [R0402]
R57  1.0k  R-US_R0402  [R0402]
R58  1.0k  R-US_R0402  [R0402]
R59  1.0k  R-US_R0402  [R0402]

### Nets
+3V3_A: C18.1 C22.1 IC4.2(AVDD) ; also sheet 1,2,3,6
AREF_2.5: IC4.7(VREF) R40.2
DAC_1: IC4.10(VOUTD) R52.2
DAC_2: IC4.11(VOUTB) R51.2
DAC_3: IC4.6(VOUTG) R53.2
DAC_4: IC4.4(VOUTC) R49.2
DAC_5: IC4.3(VOUTA) R50.2
DAC_6: IC4.5(VOUTE) R47.2
DAC_MOSI: IC4.13(DIN) ; also sheet 1
DAC_SCK: IC4.14(SCLK) ; also sheet 1
DAC_SS: IC4.1(~SYNC) ; also sheet 1
GND: C18.2 C22.2 C43.2 C50.2 C51.1 C52.2 C53.1 C54.2 C55.1 IC4.12(GND) J1.P1 J2.P1 J3.P1 J4.P1 J5.P1 J6.P1 R48.1 R54.2 R55.2 R56.2 R57.2 R58.2 R59.2 ; also sheet 1,2,3,4,6
N$65: C49.2 IC14.10(C:+IN) IC14.14(D:OUT) R39.2
N$66: J1.P3 R39.1 R46.1
N$67: J2.P3 R37.1 R45.1
N$69: J4.P3 R36.1 R43.1
N$70: C46.1 IC13.2(A:-IN) R43.2 R49.1
N$71: C48.1 IC14.2(A:-IN) R45.2 R51.1
N$72: C47.1 IC13.13(D:-IN) R44.2 R53.1
N$73: C49.1 IC14.13(D:-IN) R46.2 R52.1
N$74: J3.P3 R38.1 R44.1
N$75: IC14.9(C:-IN) LED1.2 R59.1
N$76: IC14.8(C:OUT) LED1.1
N$77: C47.2 IC13.10(C:+IN) IC13.14(D:OUT) R38.2
N$78: IC13.9(C:-IN) LED2.2 R57.1
N$79: IC13.8(C:OUT) LED2.1
N$80: C48.2 IC14.1(A:OUT) IC14.5(B:+IN) R37.2
N$81: IC14.6(B:-IN) LED5.2 R58.1
N$82: IC14.7(B:OUT) LED5.1
N$83: C46.2 IC13.1(A:OUT) IC13.5(B:+IN) R36.2
N$84: IC13.6(B:-IN) LED3.2 R56.1
N$85: IC13.7(B:OUT) LED3.1
N$86: J6.P3 R35.1 R41.1
N$87: C44.1 IC12.2(A:-IN) R41.2 R47.1
N$88: C45.1 IC12.13(D:-IN) R42.2 R50.1
N$89: J5.P3 R34.1 R42.1
N$90: C45.2 IC12.10(C:+IN) IC12.14(D:OUT) R34.2
N$91: IC12.9(C:-IN) LED6.2 R55.1
N$92: IC12.8(C:OUT) LED6.1
N$93: C44.2 IC12.1(A:OUT) IC12.5(B:+IN) R35.2
N$94: IC12.6(B:-IN) LED4.2 R54.1
N$95: IC12.7(B:OUT) LED4.1
VCC: C50.1 C52.1 C54.1 IC12.4(P:V+) IC13.4(P:V+) IC14.4(P:V+) ; also sheet 6
VEE: C51.2 C53.2 C55.2 IC12.11(P:V-) IC13.11(P:V-) IC14.11(P:V-) ; also sheet 6
VREF_BIAS: C43.1 IC12.3(A:+IN) IC12.12(D:+IN) IC13.3(A:+IN) IC13.12(D:+IN) IC14.3(A:+IN) IC14.12(D:+IN) R40.1 R48.2
Unconnected: IC4.8(VOUTH) IC4.9(VOUTF) J1.P2 J2.P2 J3.P2 J4.P2 J5.P2 J6.P2

### Notes on the sheet
- -8.1V to 8.1V | -8.1V to 8.1V
- -8.1V to 8.1V
- -8.1V to 8.1V | -8.1V to 8.1V | -8.1V to 8.1V
- 1.087V
- cc-by-sa | DAC&CV outputs
- Olivier Gillet
- ol.gillet@gmail.com

## Sheet 6 of 6
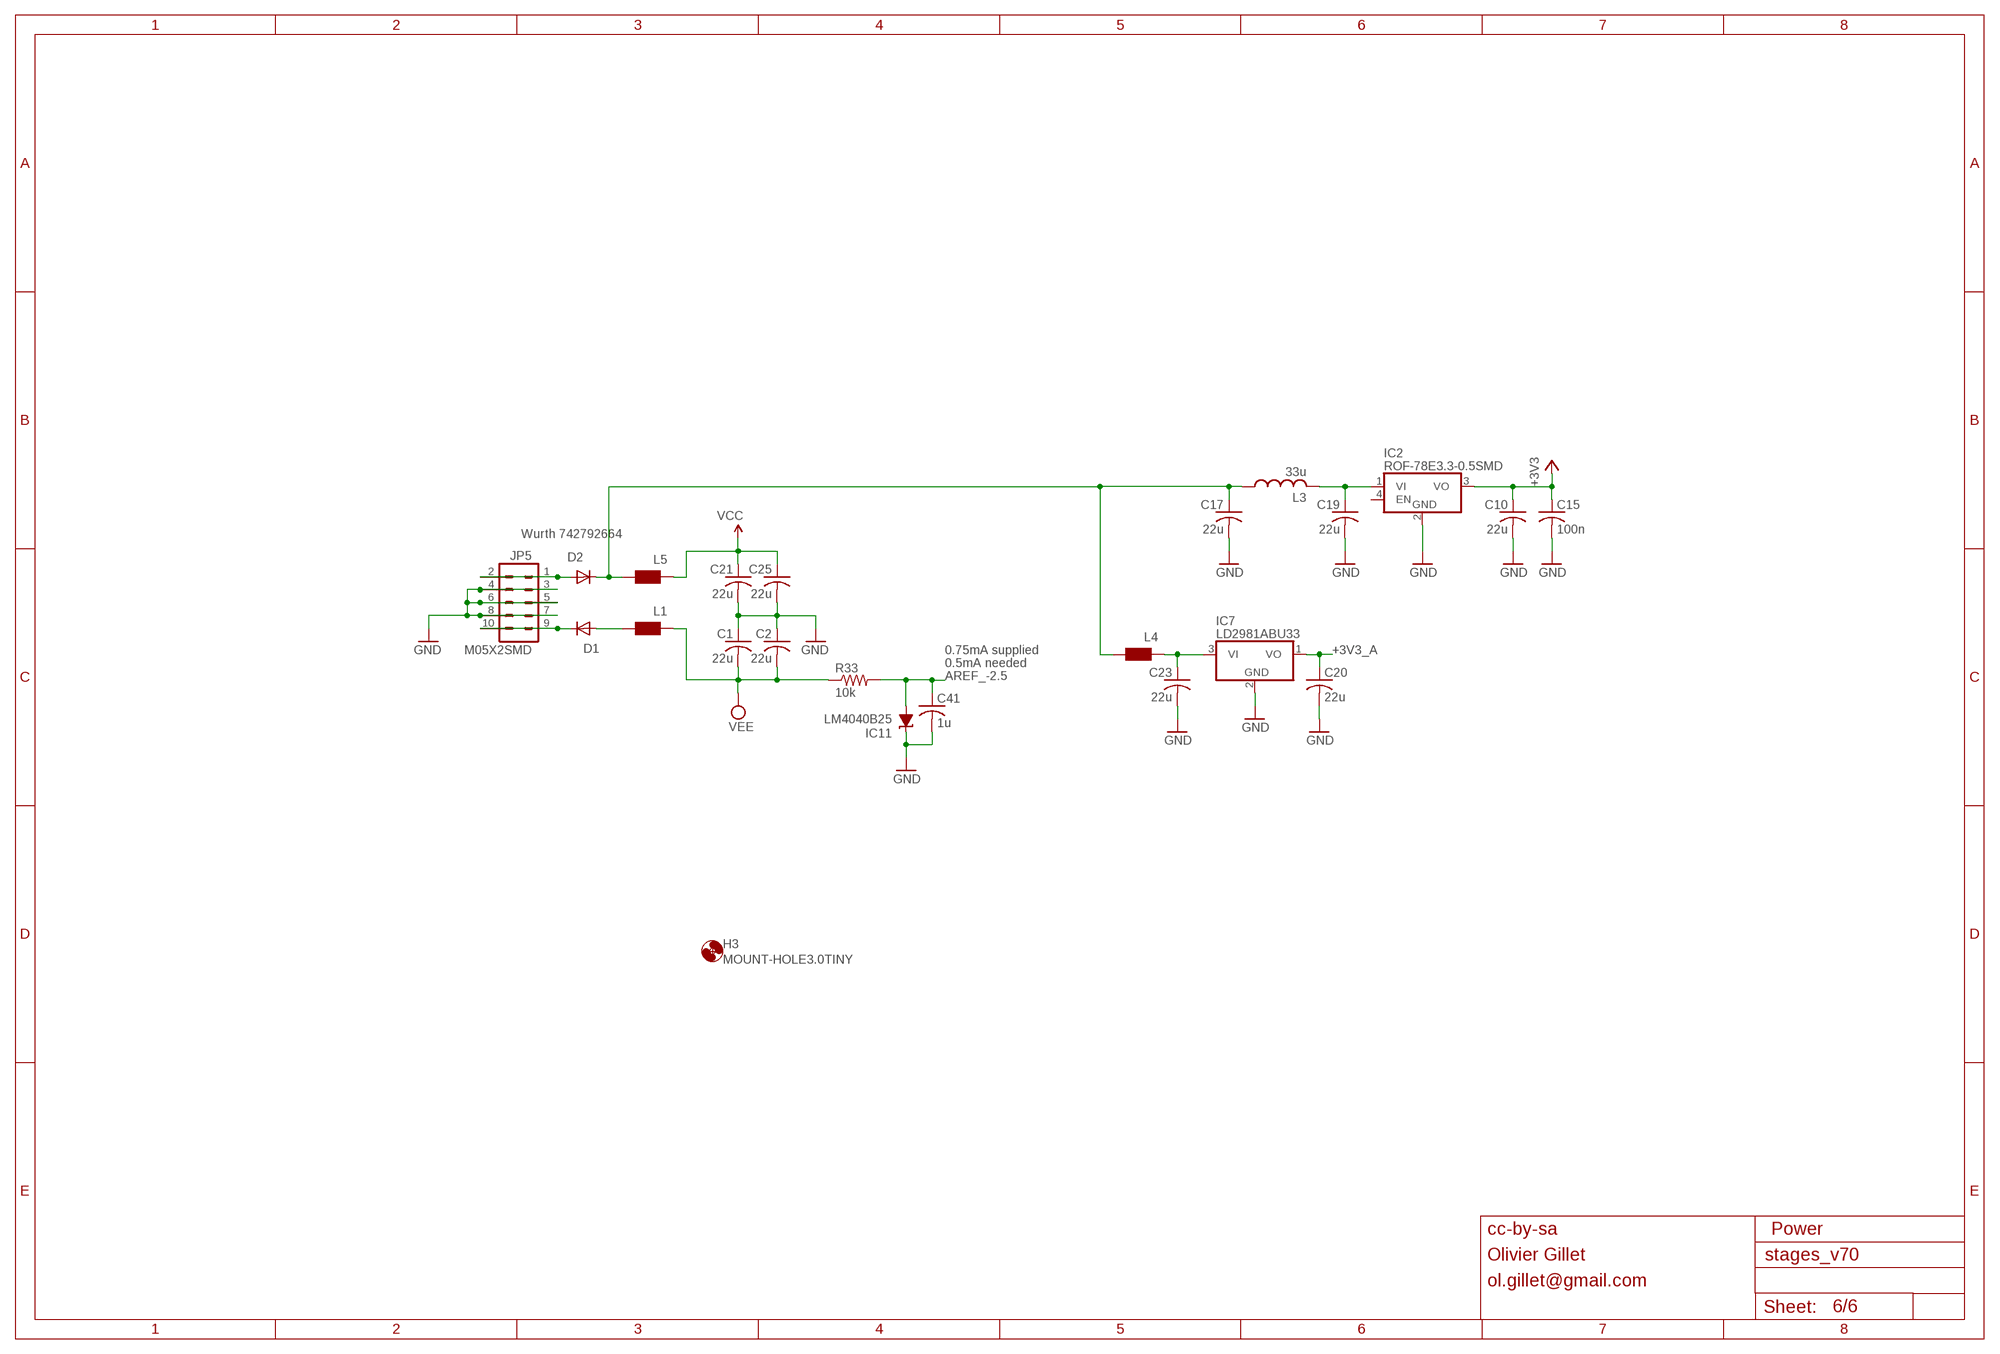
[diagram p5: schematic, sheet 6]

### Parts
C1  22u  C-USC1206  [C1206]
C2  22u  C-USC1206  [C1206]
C10  22u  C-USC1206  [C1206]
C15  100n  C-USC0402  [C0402]
C17  22u  C-USC1206  [C1206]
C19  22u  C-USC1206  [C1206]
C20  22u  C-USC1206  [C1206]
C21  22u  C-USC1206  [C1206]
C23  22u  C-USC1206  [C1206]
C25  22u  C-USC1206  [C1206]
C41  1u  C-USC0402  [C0402]
D1  1N5819HW  DIODE-SOD123  [SOD123]
D2  1N5819HW  DIODE-SOD123  [SOD123]
H3  MOUNT-HOLE3.0TINY  [3,0TINY]
IC2  ROF-78E3.3-0.5SMD  ROF-78EXX-0.55SMD  [ROF78EXX-0.5SMD]
IC7  LD2981ABU33  LD2981ABU  [SOT89]
IC11  LM4040B25  LM4041B12DBZ  [DBZ_R-PDSO-G3]
JP5  M05X2SMD  [2X5-SMD]
L1  WE-CBF_0603  [0603]
L3  33u  L-USL2012C  [L2012C]
L4  WE-CBF_0603  [0603]
L5  WE-CBF_0603  [0603]
R33  10k  R-US_R0402  [R0402]

### Nets
+3V3: C10.1 C15.1 IC2.3(VO) ; also sheet 1,2,4
+3V3_A: C20.1 IC7.1(VO) ; also sheet 1,2,3,5
AREF_-2.5: C41.1 IC11.2(A) R33.2 ; also sheet 3
GND: C1.1 C2.1 C10.2 C15.2 C17.2 C19.2 C20.2 C21.2 C23.2 C25.2 C41.2 IC2.2(GND) IC7.2(GND) IC11.1(C) JP5.3 JP5.4 JP5.5 JP5.6 JP5.7 JP5.8 ; also sheet 1,2,3,4,5
N$18: D2.A JP5.1 JP5.2
N$33: D1.A L1.2
N$35: C23.1 IC7.3(VI) L4.1
N$38: C17.1 D2.C L3.1 L4.2 L5.2
N$96: D1.C JP5.9 JP5.10
N$99: C19.1 IC2.1(VI) L3.2
VCC: C21.1 C25.1 L5.1 ; also sheet 5
VEE: C1.2 C2.2 L1.1 R33.1 ; also sheet 5
Unconnected: IC2.4(EN)

### Notes on the sheet
- Wurth 742792664
- 0.75mA supplied
- 0.5mA needed
- cc-by-sa | Power
- Olivier Gillet
- ol.gillet@gmail.com

## Library data of the parts
C1-C55 = rcl:C-US: CAPACITOR, American symbol
D1-D8 = diode:DIODE-: DIODE
D9 = diode:DIODE_2CACA-: 2 Diodes - Cathode-Anode|Cathode-Anode
H1-H3 = og-holes:MOUNT-HOLE: MOUNTING HOLE with drill center marker
IC1 = og-ics:TLC59281
IC2 = og-vreg:ROF-78EXX-0.55SMD
IC3 IC6 = og-ics:4051: 8-channel ANALOG MULTIPLEXER
IC4 = og-dac:DAC8168
IC5 = og-stm32f2:STM32F373R
IC7 = og-vreg:LD2981
IC8-IC10 = og-linear:OPA1652
IC11 = texas:LM4041: PRECISION MICROPOWER SHUNT VOLTAGE REFERENCE Source: http://focus.ti.com/lit/ds/slcs146e/slcs146e.pdf
IC12-IC14 = linear:TL074: OP AMP
J1-J18 = og-pj301_variations:PJ301_THONKICONN
JP1 JP2 JP7 JP8 = SparkFun:FIDUCIAL: Fiducial Alignment Points Various fiducial points for machine vision alignment.
JP3 JP4 = SparkFun:M03: Header 3 Standard 3-pin 0.1" header. Use with straight break away headers (SKU : PRT-00116), right angle break away headers (PRT-00553), swiss pins (PRT-00743), machine pins (PRT-00117), and female headers (PRT-00115). Molex polarized connector foot print use with SKU : PRT-08232 with associated crimp pins and housings.
JP5 = og-header:M05X2: Header 5x2 Standard 10-pin dual row 0.1" header. Commonly used with AVR-ISP. Use with Spark Fun Electronics SKU: PRT-00778
JP6 = SparkFun:M04: Header 4 Standard 4-pin 0.1" header. Use with straight break away headers (SKU : PRT-00116), right angle break away headers (PRT-00553), swiss pins (PRT-00743), machine pins (PRT-00117), and female headers (PRT-00115). Molex polarized connector foot print use with SKU : PRT-08231 with associated crimp pins and housings.
L1 L2 L4 L5 = wuerth-elektronik:WE-CBF: SMD EMI Suppression Ferrite Beads - excellent anti-EMI properties - low DCR - impedances till 3000 ohms - rated current up to 6 A
L3 = og-rcl:L-US
LED1-LED6 = og-leds:LED-BICOLOR-SHARED-THROUGHHOLE
LED7-LED12 = og-leds:LED-BICOLOR-THROUGHHOLE-CA
Q1 = og-crystal:CRYSTAL: Crystal with 2 extra terminals for the metal LID (Abracon ABMM2 for example)
Q2-Q7 = transistor:*-NPN-: NPN Transistror BF959 corrected 2008.03.06
R1-R77 = rcl:R-US_: RESISTOR, American symbol
R78-R83 = og-pots:BOURNS_SLIDER
R84-R89 = og-pots:POT_US
SW1-SW6 = SparkFun:TAC_SWITCH: Momentary Switch Button commonly used for reset or general input. Spark Fun Electronics SKU : COM-00097